# Altium project Coil_Driver.PrjPcb (part 3 of 3)

## Sheet Regulators.SchDoc
size A4
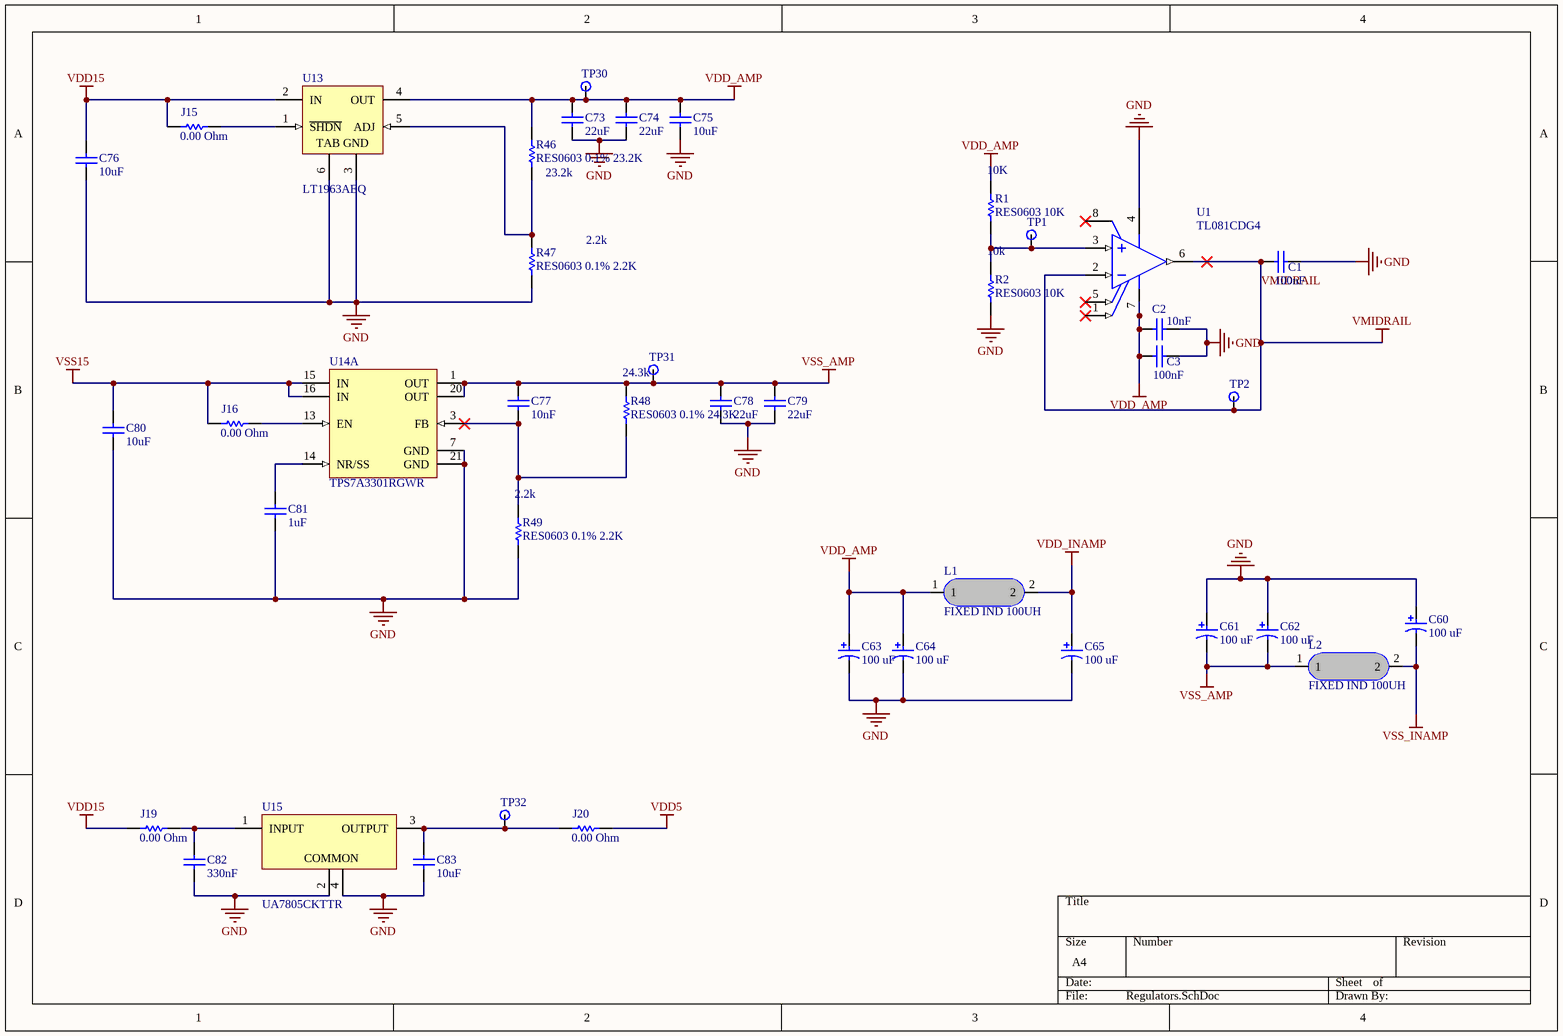
[diagram p8: Regulators.SchDoc]

### Parts
C1  value 100nF  [CAPC0603(1608)100_M]  (hidden comment: CAP 100nF 25V 0603(1608))
C2  value 10nF  [CAPC0603(1608)100_N]  (hidden comment: CAP 10nF 25V 0603(1608))
C3  value 100nF  [CAPC0603(1608)100_M]  (hidden comment: CAP 100nF 25V 0603(1608))
C60  100 uF  [CAPPR55-250-1120X630X1220]
C61  100 uF  [CAPPR55-250-1120X630X1220]
C62  100 uF  [CAPPR55-250-1120X630X1220]
C63  100 uF  [CAPPR55-250-1120X630X1220]
C64  100 uF  [CAPPR55-250-1120X630X1220]
C65  100 uF  [CAPPR55-250-1120X630X1220]
C73  value 22uF  [CAPC1206(3216)190_M]  (hidden comment: CAP 22uF 25V 1206(3216))
C74  value 22uF  [CAPC1206(3216)190_M]  (hidden comment: CAP 22uF 25V 1206(3216))
C75  value 10uF  [CAPC1206(3216)190_L]  (hidden comment: CAP 10uF 25V 1206(3216))
C76  value 10uF  [CAPC1206(3216)190_L]  (hidden comment: CAP 10uF 25V 1206(3216))
C77  value 10nF  [CAPC0603(1608)100_N]  (hidden comment: CAP 10nF 25V 0603(1608))
C78  value 22uF  [CAPC1206(3216)190_M]  (hidden comment: CAP 22uF 25V 1206(3216))
C79  value 22uF  [CAPC1206(3216)190_M]  (hidden comment: CAP 22uF 25V 1206(3216))
C80  value 10uF  [CAPC1206(3216)190_L]  (hidden comment: CAP 10uF 25V 1206(3216))
C81  value 1uF  [CAPC0603(1608)100_L]  (hidden comment: CAP 1uF 25V 0603(1608))
C82  value 330nF  [CAPC0603(1608)100_L]  (hidden comment: CAP 330nF 25V 0603(1608))
C83  value 10uF  [CAPC1206(3216)190_L]  (hidden comment: CAP 10uF 25V 1206(3216))
J15  0.00 Ohm  [RESC1206(3216)_M]
J16  0.00 Ohm  [RESC1206(3216)_M]
J19  0.00 Ohm  [RESC1206(3216)_M]
J20  0.00 Ohm  [RESC1206(3216)_M]
L1  FIXED IND 100UH  [FIXED IND 100UH 520MA 850 MOHM]
L2  FIXED IND 100UH  [FIXED IND 100UH 520MA 850 MOHM]
R1  RES0603 10K  value 10K  [RESC0603(1608)_L]
R2  RES0603 10K  value 10k  [RESC0603(1608)_L]
R46  RES0603 0.1% 23.2K  value 23.2k  [RESC0603(1608)_L]
R47  RES0603 0.1% 2.2K  value 2.2k  [RESC0603(1608)_L]
R48  RES0603 0.1% 24.3K  value 24.3k  [RESC0603(1608)_L]
R49  RES0603 0.1% 2.2K  value 2.2k  [RESC0603(1608)_L]
TP1  Testpoint  [0603 PROBE PAD]  (value not drawn)
TP2  Testpoint  [0603 PROBE PAD]  (value not drawn)
TP30  Testpoint  [0603 PROBE PAD]  (value not drawn)
TP31  Testpoint  [0603 PROBE PAD]  (value not drawn)
TP32  Testpoint  [0603 PROBE PAD]  (value not drawn)
U1  TL081CDG4  [TI-D8_N]
U13  LT1963AEQ  [LT-Q-5_M]
U14  TPS7A3301RGWR  [RGW0020A_V]  (part A of 2)
U15  UA7805CKTTR  [KTT0003A_V]

### Nets
GND: C1.1 C2.2 C3.1 C60.1 C61.1 C62.1 C63.2 C64.2 C65.2 C73.2 C74.2 C75.2 C76.2 C78.2 C79.2 C80.2 C81.1 C82.1 C83.2 R2.1 R47.1 R49.1 U1.4(VCC-) U13.3(GND) U13.6(TAB) U14.7(GND) U14.21(GND) U15.2(COMMON) U15.4(COMMON)
VDD5: J20.2
VDD15: C76.1 J15.1 J19.1 U13.2(IN)
VDD_AMP: C2.1 C3.2 C63.1 C64.1 C73.1 C74.1 C75.1 L1.1 R1.2 R46.2 TP30.0 U1.7(VCC+) U13.4(OUT)
VDD_INAMP: C65.1 L1.2
VMIDRAIL: C1.2 TP2.0 U1.2(IN-) U1.6(OUT)
VSS15: C80.1 J16.1 U14.15(IN) U14.16(IN)
VSS_AMP: C61.2 C62.2 C77.2 C78.1 C79.1 L2.1 R48.2 TP31.0 U14.1(OUT) U14.20(OUT)
VSS_INAMP: C60.2 L2.2
NetC77_1: C77.1 R48.1 R49.2 U14.3(FB)
NetC81_2: C81.2 U14.14(NR/SS)
NetC82_2: C82.2 J19.2 U15.1(INPUT)
NetC83_1: C83.1 J20.1 TP32.0 U15.3(OUTPUT)
NetJ15_2: J15.2 U13.1(~{SHDN})
NetJ16_2: J16.2 U14.13(EN)
NetR1_1: R1.1 R2.2 TP1.0 U1.3(IN+)
NetR46_1: R46.1 R47.2 U13.5(ADJ)

Not connected (* = marked no-connect by the designer): U1 1(OFFSET_N1)* 5(OFFSET_N2)* 8(NC)*

### Library data of the parts
C1 C3 = CMP-1035-02588-1: as C7 on sheet ChannelDriver; Max Thickness: 1 mm; Technology: SMT; Rated Voltage: 25 V; OrderURL: http://www.digikey.ie/product-detail/en/yageo/CC0603KRX7R8BB104/311-1341-1-ND/2103125; Supplier 1: Digi-Key; Supplier Part Number 1: 311-1341-1-ND
C2 C77 = CMP-1035-02317-1: as C4 on sheet ChannelDriver; Max Thickness: 1 mm; Rated Voltage: 25 V; Technology: SMT; OrderURL: http://www.digikey.ie/product-detail/en/yageo/CC0603KRX7R8BB103/311-1360-1-ND/2103144; Supplier 1: Digi-Key; Supplier Part Number 1: 311-1360-1-ND
C60-C65 = CMP-1665-00015-4: Aluminum Electrolytic Capacitor (Radial Lead Type), 100 uF, 35 V, -40 to 85 degC, 2-Pin THD, RoHS, Bulk; Manufacturer: Panasonic; Voltage Rating: 35 V; PackageReference: Radial; ComponentLink2URL: http://industrial.panasonic.com/cdbs/www-data/pdf/RDF0000/ABA0000C1047.pdf; DatasheetVersion: 03/2016; REACH SVHC: No SVHC; Mounting Technology: Through Hole; ComponentLink2Description: Datasheet; Packaging: Bulk; Lead Pitch: 2.5 mm; Height: 11.2 mm; Pins: 2; RoHSCompliant: true; Mount: Through Hole; Package Quantity: 200; Min Operating Temperature: -40 degC; Max Operating Temperature: 85 degC; PackageDescription: 2-Pin Through Hole Device, Dia 6.3 mm, Body Length 11.2 mm; ComponentLink1Description: Manufacturer URL; Length: 11.2 mm; ComponentLink1URL: http://www.panasonic.com/
C73 C74 C78 C79 = CMP-1037-04995-1: CAP 22uF 25V ±20% 1206 (3216 Metric) Thickness 1.9mm SMD; Case-EIA: 1206; Tolerance: Â±20%; Case-Metric: 3216; Rated Voltage: 25 V; Technology: SMT; Max Thickness: 1.9 mm; OrderURL: http://www.digikey.ie/product-detail/en/taiyo-yuden/TMK316BBJ226ML-T/587-3246-1-ND/3660105; Supplier Part Number 1: 587-3246-1-ND; Supplier 1: Digi-Key
C75 C76 C80 C83 = CMP-1037-04979-1: CAP 10uF 25V ±10% 1206 (3216 Metric) Thickness 1.9mm SMD; Case-EIA: 1206; Tolerance: Â±10%; Case-Metric: 3216; Rated Voltage: 25 V; Technology: SMT; Max Thickness: 1.9 mm; OrderURL: http://www.digikey.ie/product-detail/en/murata-electronics-north-america/GRM319R61E106KA12D/490-5525-1-ND/2334921; Supplier 1: Digi-Key; Supplier Part Number 1: 490-5525-1-ND
C81 = CMP-1035-02740-1: CAP 1uF 25V ±10% 0603 (1608 Metric) Thickness 1mm SMD; Tolerance: Â±10%; Case-Metric: 1608; Case-EIA: 0603; Technology: SMT; Rated Voltage: 25 V; Max Thickness: 1 mm; OrderURL: http://www.digikey.ie/product-detail/en/taiyo-yuden/TMK107BJ105KA-T/587-1248-1-ND/931025; Supplier Part Number 1: 587-1248-1-ND; Supplier 1: Digi-Key
C82 = CMP-1035-02674-1: CAP 330nF 25V ±10% 0603 (1608 Metric) Thickness 1mm SMD; Tolerance: Â±10%; Case-Metric: 1608; Case-EIA: 0603; Max Thickness: 1 mm; Technology: SMT; Rated Voltage: 25 V
J15 J16 J19 J20 = CMP-1014-00001-1: Jumper 1206 (3216 Metric); Tolerance: None; Case-EIA: 1206; Case-Metric: 3216; Technology: SMT; Power: None; Value: 0.00 Ohm; OrderURL: http://www.digikey.ie/product-detail/en/yageo/RC0603JR-070RL/311-0.0GRCT-ND/729622; Supplier 1: Digi-Key; Supplier Part Number 1: 311-0.0GRCT-ND
L1 L2 = 74408943101: FIXED IND 100UH 520MA 850 MOHM; Manufacturer: Wurth Electronics Inc.; Type: Wirewound; Material - Core: Ferrite; Inductance: 100µH; Tolerance: ±20%; Current - Saturation: 680mA; Shielding: Shielded; DC Resistance (DCR): 850 mOhm Max; Frequency - Self Resonant: 7.8MHz; Frequency - Test: 100kHz; Value: 1K; Published: 8-Jun-2000; LatestRevisionDate: 29-May-2009; LatestRevisionNote: IPC-7351 Footprint Added.; PackageReference: J1-0603; Publisher: Altium Limited; PackageDescription: Chip Resistor; Manufacturer Part Number: 74408943101; RoHS: RoHS Compliant; Category: Inductors, Coils, Chokes; Packaging: Tape & Reel (TR); Part Status: Active; Current Rating: 520mA; Q @ Freq: -; Ratings: -; Operating Temperature: -40°C ~ 125°C; Mounting Type: Surface Mount; Package / Case: Nonstandard; Supplier Device Package: -; Size / Dimension: 0.189" L x 0.189" W (4.80mm x 4.80mm); Height - Seated (Max): 0.161" (4.10mm); ComponentLink1URL: http://katalog.we-online.de/pbs/datasheet/74408943101.pdf; ComponentLink1Description: http://katalog.we-online.de/pbs/datasheet/74408943101.pdf; Supplier 1: Digi-Key; Supplier Part Number 1: 732-3038-2-ND; Stock 1: 9500; Pricing 1: 500=1.84552 (EUR)
R1 R2 = CMP-1591-00001-1: 0603 (1608 Metric) Chip Resistor; Manufacturer: Yageo; Manufacturer Part Number: RT0603BRD0710KL; Case-Metric: 1608; Case-EIA: 0603; Power (Watts): 0.1W, 1/10W; Temperature Coefficient: ±25ppm/°C; PackageReference: RESC0603(1608); Supplier 1: Digi-Key; Supplier Part Number 1: YAG1236CT-ND; RoHS: RoHS Compliant; Category: Resistors; Stock 1: 62928; Pricing 1: 1=0.3, 10=0.254, 25=0.1844, 50=0.1336, 100=0.0991, 250=0.07608, 500=0.05994, 1000=0.0415 (EUR); Packaging: Cut Tape (CT); Part Status: Active; Resistance (Ohms): 10k; Composition: Thin Film; Features: Moisture Resistant; Operating Temperature: -55°C ~ 155°C; Package / Case: 0603 (1608 Metric); Supplier Device Package: 0603; Size / Dimension: 0.063" L x 0.031" W (1.60mm x 0.80mm); Height - Seated (Max): 0.022" (0.55mm); Failure Rate: -; ComponentLink1URL: http://www.yageo.com/documents/recent/PYu-RT_1-to-0.01_RoHS_L_7.pdf; ComponentLink1Description: http://www.yageo.com/documents/recent/PYu-RT_1-to-0.01_RoHS_L_7.pdf
R46 = CMP-1591-00001-1: 0603 (1608 Metric) Chip Resistor; Manufacturer: Panasonic Electronic Components; Manufacturer Part Number: ERA-3AEB2322V; Case-Metric: 1608; Case-EIA: 0603; Power (Watts): 0.1W, 1/10W; Temperature Coefficient: ±25ppm/°C; PackageReference: RESC0603(1608); Supplier 1: Digi-Key; Supplier Part Number 1: P23.2KDBCT-ND; RoHS: RoHS Compliant; Category: Resistors; Stock 1: 17441; Pricing 1: 1=0.37, 10=0.27, 25=0.196, 50=0.1422, 100=0.1054, 250=0.08088, 500=0.06372, 1000=0.04411 (EUR); Packaging: Cut Tape (CT); Part Status: Active; Resistance (Ohms): 23.2k; Composition: Thin Film; Features: Automotive AEC-Q200; Operating Temperature: -55°C ~ 155°C; Package / Case: 0603 (1608 Metric); Supplier Device Package: 0603; Size / Dimension: 0.063" L x 0.031" W (1.60mm x 0.80mm); Height - Seated (Max): 0.022" (0.55mm); Failure Rate: -; ComponentLink1URL: https://industrial.panasonic.com/cdbs/www-data/pdf/RDM0000/AOA0000C237.pdf; ComponentLink1Description: https://industrial.panasonic.com/cdbs/www-data/pdf/RDM0000/AOA0000C237.pdf
R47 R49 = CMP-1591-00001-1: 0603 (1608 Metric) Chip Resistor; Manufacturer: Panasonic Electronic Components; Manufacturer Part Number: ERA-3AEB222V; Case-Metric: 1608; Case-EIA: 0603; Power (Watts): 0.1W, 1/10W; Temperature Coefficient: ±25ppm/°C; PackageReference: RESC0603(1608); Supplier 1: Digi-Key; Supplier Part Number 1: P2.2KDBCT-ND; RoHS: RoHS Compliant; Category: Resistors; Stock 1: 91131; Pricing 1: 1=0.37, 10=0.27, 25=0.196, 50=0.1422, 100=0.1054, 250=0.08088, 500=0.06372, 1000=0.04411 (EUR); Packaging: Cut Tape (CT); Part Status: Active; Resistance (Ohms): 2.2k; Composition: Thin Film; Features: Automotive AEC-Q200; Operating Temperature: -55°C ~ 155°C; Package / Case: 0603 (1608 Metric); Supplier Device Package: 0603; Size / Dimension: 0.063" L x 0.031" W (1.60mm x 0.80mm); Height - Seated (Max): 0.022" (0.55mm); Failure Rate: -; ComponentLink1URL: https://industrial.panasonic.com/cdbs/www-data/pdf/RDM0000/AOA0000C237.pdf; ComponentLink1Description: https://industrial.panasonic.com/cdbs/www-data/pdf/RDM0000/AOA0000C237.pdf
R48 = CMP-1591-00001-1: 0603 (1608 Metric) Chip Resistor; Manufacturer: Panasonic Electronic Components; Manufacturer Part Number: ERA-3AEB2432V; Case-Metric: 1608; Case-EIA: 0603; Power (Watts): 0.1W, 1/10W; Temperature Coefficient: ±25ppm/°C; PackageReference: RESC0603(1608); Supplier 1: Digi-Key; Supplier Part Number 1: P24.3KDBCT-ND; RoHS: RoHS Compliant; Category: Resistors; Stock 1: 12451; Pricing 1: 1=0.37, 10=0.27, 25=0.196, 50=0.1422, 100=0.1054, 250=0.08088, 500=0.06372, 1000=0.04411 (EUR); Packaging: Cut Tape (CT); Part Status: Active; Resistance (Ohms): 24.3k; Composition: Thin Film; Features: Automotive AEC-Q200; Operating Temperature: -55°C ~ 155°C; Package / Case: 0603 (1608 Metric); Supplier Device Package: 0603; Size / Dimension: 0.063" L x 0.031" W (1.60mm x 0.80mm); Height - Seated (Max): 0.022" (0.55mm); Failure Rate: -; ComponentLink1URL: https://industrial.panasonic.com/cdbs/www-data/pdf/RDM0000/AOA0000C237.pdf; ComponentLink1Description: https://industrial.panasonic.com/cdbs/www-data/pdf/RDM0000/AOA0000C237.pdf
TP1 TP2 TP30-TP32 = Testpoint: as TP3 on sheet ChannelDriver; OrderURL: http://www.digikey.ie/product-detail/en/te-connectivity-amp-connectors/RCU-0C/A106145CT-ND/3477802; Value: *; Width: 0.8; Height: 1.15mm; Length: 1.60mm; Supplier Part Number 1: A106145CT-ND; Supplier 1: Digi-Key
U1 = CMP-0017-00506-1: as U2 on sheet ChannelDriver; ComponentLink3Description: Package Specification; Eco-Plan: Green (RoHS & no Sb/Br); PackageReference: D8; ComponentLink1Description: Manufacturer URL; PackageDescription: 8-Pin Plastic Small Outline, Body 4.9 x 3.9 mm, Pitch 1.27 mm; DatasheetVersion: SLOS081G; PackageVersion: 4040047-3/M, 06/2011; Code_JEDEC: MS-012; ComponentLink2URL: http://www.ti.com/lit/ds/symlink/tl081.pdf; ComponentLink1URL: http://www.ti.com/; Offset Drift(Typ)(uV/C): 18; Mounting Technology: Surface Mount; ComponentLink2Description: Datasheet; PartNumber: TL081CDG4; ComponentLink3URL: http://www.ti.com/litv/pdf/msoi002j; OrderURL: http://www.digikey.ie/product-detail/en/texas-instruments/TL081CDR/296-15001-1-ND/562657; Supplier 1: Digi-Key; RoHS: RoHS Compliant; Category: Integrated Circuits (ICs); Stock 1: 9909; Pricing 1: 1=0.44, 10=0.375, 100=0.28, 500=0.22002, 1000=0.17001 (EUR); Packaging: Cut Tape (CT); Part Status: Active; Number of Circuits: 1; Output Type: -; -3db Bandwidth: -; Current - Output / Channel: -; Operating Temperature: 0°C ~ 70°C; Mounting Type: Surface Mount; Package / Case: 8-SOIC (0.154", 3.90mm Width); Supplier Device Package: 8-SOIC; ComponentLink4URL: http://www.ti.com/lit/ds/symlink/tl081a.pdf; ComponentLink4Description: http://www.ti.com/lit/ds/symlink/tl081a.pdf
U13 = CMP-0476-01172-1: 1.5 A, Low Noise, Fast Transient Response LDO Regulator, 2.1 to 20 V Vin, Adjustable Vout, 5-pin DPAK (Q-5), -40 to 125 degC; Manufacturer: Linear Technology; Iout(mA): 1500; Isupply(mA): 1; Noise(uV): 40; Vin Max(V): 20; Shutdown Current(uA): 0.01; Discrete Pass Element: no; Output Voltage: Adj; Vin Min(V): 2.1; Dropout Voltage(V): 0.34; Vout Min(V): 1.21; PSRR(dB): 63; PackageReference: Q-5; Number of Outputs: 1; ComponentLink2URL: http://cds.linear.com/docs/en/datasheet/1963afe.pdf; ComponentLink2Description: Datasheet; Mounting Technology: Surface Mount; DatasheetVersion: Rev. E; ComponentLink3URL: http://cds.linear.com/docs/en/packaging/Q%20DD5%2005-08-1461%20Rev%20F.pdf; ComponentLink1Description: Manufacturer URL; PackageDescription: 5-Pin Plastic DD Pak, Body 10.2235 x 8.89 mm, Pitch 1.702 mm; ComponentLink3Description: Package Specification; Vout Max(V): 20; ComponentLink1URL: http://www.linear.com/; PackageVersion: Rev. F, 09/2011; RoHS: FALSE; PartNumber: LT1963AEQ
U14 = CMP-0395-01391-2: Single Output High PSRR LDO, 1 A, Adjustable -1.18 to -33 V Output, -3 to -36 V Input, with Ultra-Low Noise, 20-pin VQFN (RGW), -40 to 125 degC, Green (RoHS & no Sb/Br); Manufacturer: Texas Instruments; SubFamily: Single Channel LDO; Vdo(Typ)(mV): 290; Iq(Typ)(mA): 0.21; Iout(Max)(A): 1; Accuracy(%): 1.5; PackageDescription: 20-Pin Plastic Quad Flat No-Pin, 5 x 5 mm Body, 0.65 mm Pitch, 3.15 x 3.15 mm Exposed Pad; DatasheetVersion: SBVS169B; ComponentLink1Description: Manufacturer URL; ComponentLink2Description: Datasheet; PartNumber: TPS7A3301RGWR; Eco-Plan: Green (RoHS & no Sb/Br); Vin(Min)(V): -3; ComponentLink2URL: http://www.ti.com/general/docs/lit/getliterature.tsp?genericPartNumber=TPS7A3301&fileType=pdf; ComponentLink3Description: Package Specification; PackageReference: RGW0020A; Vout Adj(Max)(V): -33; Vin(Max)(V): -36; Vout Adj(Min)(V): -1.18; ComponentLink1URL: http://www.ti.com/; Code_JEDEC: MO-220; ComponentLink3URL: http://www.ti.com/litv/pdf/mpqf122b; Mounting Technology: Surface Mount
U15 = CMP-1685-00014-1: Fixed Positive Voltage Regulator, 7 to 25 V, 1.5 A, 0 to 125 degC, 3-Pin DDPAK (KTT), Green (RoHS / & no Sb/Br), Tape and Reel; Tolerance: 1%; Resistance: 220 Ohm; Case\Package: 0603; Voltage Rating: 50 V; Power Rating: 100 mW; Package Quantity: 5000; Min Operating Temperature: -55 degC; ComponentLink2Description: Datasheet; ComponentLink1Description: Manufacturer URL; RoHSCompliant: true; Mount: Surface Mount; PackageDescription: 3-Pin Surface Mount Device, Body 10.16 x 9.015 mm, Pitch 2.54 mm; Width: 0.8 mm; Max Operating Temperature: 155 degC; Pins: 2; ComponentLink1URL: http://www.ti.com/; Case Code (Metric): 1608; Packaging: Tape and Reel; Case Code (Imperial): 0603; Height: 0.45 mm; Code_JEDEC: TO-263; DatasheetVersion: SLVS056P, 01/2015; Length: 1.6 mm; REACH SVHC: No SVHC; ComponentLink2URL: http://www.ti.com/lit/ds/symlink/ua7805.pdf; PackageReference: KTT0003A; Voltage Rating (DC): 50 V

## Sheet CurrentSense.SchDoc
size A4
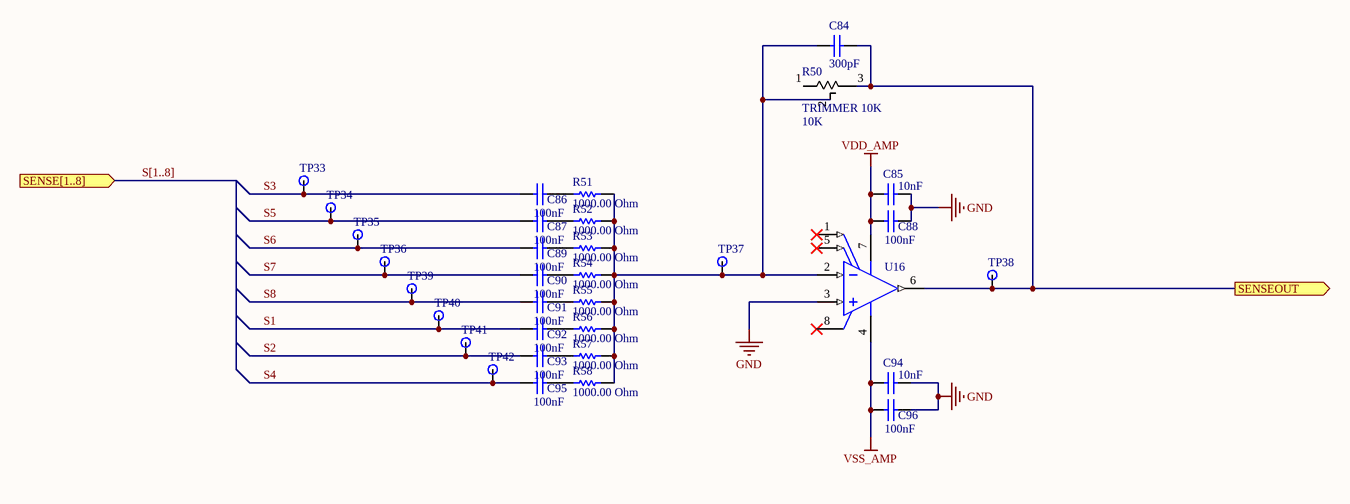
[diagram p9: CurrentSense.SchDoc]

### Parts
C84  value 300pF  [CAPC0603(1608)100_N]  (hidden comment: CAP 300pF 25V 0603(1608))
C85  value 10nF  [CAPC0603(1608)100_N]  (hidden comment: CAP 10nF 25V 0603(1608))
C86  value 100nF  [CAPC0603(1608)100_M]  (hidden comment: CAP 100nF 25V 0603(1608))
C87  value 100nF  [CAPC0603(1608)100_M]  (hidden comment: CAP 100nF 25V 0603(1608))
C88  value 100nF  [CAPC0603(1608)100_M]  (hidden comment: CAP 100nF 25V 0603(1608))
C89  value 100nF  [CAPC0603(1608)100_M]  (hidden comment: CAP 100nF 25V 0603(1608))
C90  value 100nF  [CAPC0603(1608)100_M]  (hidden comment: CAP 100nF 25V 0603(1608))
C91  value 100nF  [CAPC0603(1608)100_M]  (hidden comment: CAP 100nF 25V 0603(1608))
C92  value 100nF  [CAPC0603(1608)100_M]  (hidden comment: CAP 100nF 25V 0603(1608))
C93  value 100nF  [CAPC0603(1608)100_M]  (hidden comment: CAP 100nF 25V 0603(1608))
C94  value 10nF  [CAPC0603(1608)100_N]  (hidden comment: CAP 10nF 25V 0603(1608))
C95  value 100nF  [CAPC0603(1608)100_M]  (hidden comment: CAP 100nF 25V 0603(1608))
C96  value 100nF  [CAPC0603(1608)100_M]  (hidden comment: CAP 100nF 25V 0603(1608))
R50  TRIMMER 10K  value 10K  [TRIMMER 10K]
R51  value 1000.00 Ohm  [RESC0603(1608)_L]  (hidden comment: 1K 5% 0603(1608))
R52  value 1000.00 Ohm  [RESC0603(1608)_L]  (hidden comment: 1K 5% 0603(1608))
R53  value 1000.00 Ohm  [RESC0603(1608)_L]  (hidden comment: 1K 5% 0603(1608))
R54  value 1000.00 Ohm  [RESC0603(1608)_L]  (hidden comment: 1K 5% 0603(1608))
R55  value 1000.00 Ohm  [RESC0603(1608)_L]  (hidden comment: 1K 5% 0603(1608))
R56  value 1000.00 Ohm  [RESC0603(1608)_L]  (hidden comment: 1K 5% 0603(1608))
R57  value 1000.00 Ohm  [RESC0603(1608)_L]  (hidden comment: 1K 5% 0603(1608))
R58  value 1000.00 Ohm  [RESC0603(1608)_L]  (hidden comment: 1K 5% 0603(1608))
TP33  Testpoint  [0603 PROBE PAD]  (value not drawn)
TP34  Testpoint  [0603 PROBE PAD]  (value not drawn)
TP35  Testpoint  [0603 PROBE PAD]  (value not drawn)
TP36  Testpoint  [0603 PROBE PAD]  (value not drawn)
TP37  Testpoint  [0603 PROBE PAD]  (value not drawn)
TP38  Testpoint  [0603 PROBE PAD]  (value not drawn)
TP39  Testpoint  [0603 PROBE PAD]  (value not drawn)
TP40  Testpoint  [0603 PROBE PAD]  (value not drawn)
TP41  Testpoint  [0603 PROBE PAD]  (value not drawn)
TP42  Testpoint  [0603 PROBE PAD]  (value not drawn)
U16  TL081CDG4  [TI-D8_N]  (value not drawn)

### Ports
SENSE[1..8] (in), SENSEOUT (out)

### Nets
GND: C85.2 C88.1 C94.2 C96.1 U16.3(IN+)
VDD_AMP: C85.1 C88.2 U16.7(VCC+)
VSS_AMP: C94.1 C96.2 U16.4(VCC-)
S1: C92.2 TP40.0  [project net Coil_In1]
S2: C93.2 TP41.0  [project net Coil_In2]
S3: C86.2 TP33.0  [project net Coil_In3]
S4: C95.2 TP42.0  [project net Coil_In4]
S5: C87.2 TP34.0  [project net Coil_In5]
S6: C89.2 TP35.0  [project net Coil_In6]
S7: C90.2 TP36.0  [project net Coil_In7]
S8: C91.2 TP39.0  [project net Coil_In8]
SENSEIN: C84.1 R50.3 TP38.0 U16.6(OUT) ; port SENSEOUT
NetC84_2: C84.2 R50.2 R51.1 R52.1 R53.1 R54.1 R55.1 R56.1 R57.1 R58.1 TP37.0 U16.2(IN-)
NetC86_1: C86.1 R51.2
NetC87_1: C87.1 R52.2
NetC89_1: C89.1 R53.2
NetC90_1: C90.1 R54.2
NetC91_1: C91.1 R55.2
NetC92_1: C92.1 R56.2
NetC93_1: C93.1 R57.2
NetC95_1: C95.1 R58.2

Not connected (* = marked no-connect by the designer): R50 1; U16 1(OFFSET_N1)* 5(OFFSET_N2)* 8(NC)*

### Buses and harness runs
bus S[1..8] = port SENSE[1..8]

### Library data of the parts
C84 = CMP-1035-01546-1: CAP 300pF 25V ±10% 0603 (1608 Metric) Thickness 1mm SMD; Tolerance: Â±10%; Case-EIA: 0603; Case-Metric: 1608; Rated Voltage: 25 V; Technology: SMT; Max Thickness: 1 mm
C85 C94 = CMP-1035-02317-1: CAP 10nF 25V ±10% 0603 (1608 Metric) Thickness 1mm SMD; Tolerance: Â±10%; Case-Metric: 1608; Case-EIA: 0603; Max Thickness: 1 mm; Rated Voltage: 25 V; Technology: SMT; OrderURL: http://www.digikey.ie/product-detail/en/yageo/CC0603KRX7R8BB103/311-1360-1-ND/2103144; Supplier 1: Digi-Key; Supplier Part Number 1: 311-1360-1-ND
C86-C93 C95 C96 = CMP-1035-02588-1: CAP 100nF 25V ±10% 0603 (1608 Metric) Thickness 1mm SMD; Case-Metric: 1608; Case-EIA: 0603; Tolerance: Â±10%; Max Thickness: 1 mm; Technology: SMT; Rated Voltage: 25 V; OrderURL: http://www.digikey.ie/product-detail/en/yageo/CC0603KRX7R8BB104/311-1341-1-ND/2103125; Supplier 1: Digi-Key; Supplier Part Number 1: 311-1341-1-ND
R50 = TRIMMER 10K: TRIMMER 10K OHM 0.5W TH; Manufacturer: TE Connectivity Passive Product; Manufacturer Part Number: 1-1623849-0; Power (Watts): 0.5W, 1/2W; Tolerance: ±10%; Temperature Coefficient: ±100ppm/°C; Number of Turns: 25; Adjustment Type: Top Adjustment; Resistive Material: Cermet; Published: 8-Jun-2000; LatestRevisionDate: 29-May-2009; LatestRevisionNote: IPC-7351 Footprint Added.; PackageReference: J1-0603; Publisher: Altium Limited; PackageDescription: Chip Resistor; RoHS: RoHS Compliant; Category: Potentiometers, Variable Resistors; Packaging: Bulk; Part Status: Active; Resistance (Ohms): 10k; Mounting Type: Through Hole; Termination Style: PC Pins; Size / Dimension: Rectangular - 0.374" x 0.185" Face x 0.394" H (9.50mm x 4.70mm x 10.00mm); ComponentLink1URL: http://www.te.com/commerce/DocumentDelivery/DDEController?Action=srchrtrv&DocNm=1623849&DocType=Customer+Drawing&DocLang=English; ComponentLink1Description: http://www.te.com/commerce/DocumentDelivery/DDEController?Action=srchrtrv&DocNm=1623849&DocType=Customer+Drawing&DocLang=English; Supplier 1: Digi-Key; Supplier Part Number 1: A105870-ND; Stock 1: 5809; Pricing 1: 1=0.89, 10=0.786, 25=0.7076, 50=0.6816, 100=0.6554, 250=0.61608, 500=0.5243, 1000=0.48499, 5000=0.39848 (EUR)
R51-R58 = CMP-1012-00074-1: 1K 0.1W 5% 0603 (1608 Metric)  SMD; Case-EIA: 0603; Case-Metric: 1608; Technology: SMT; Tolerance: 5 %; Power: 0.1 W; OrderURL: http://www.digikey.ie/product-detail/en/yageo/RC0603JR-071KL/311-1.0KGRCT-ND/729624; Supplier 1: Digi-Key; Supplier Part Number 1: 311-1.0KGRCT-ND
TP33-TP42 = Testpoint: 0.063" x 0.031" x 0.045" (1.60mm x 0.80mm x 1.15mm); OrderURL: http://www.digikey.ie/product-detail/en/te-connectivity-amp-connectors/RCU-0C/A106145CT-ND/3477802; Value: *; Width: 0.8; Height: 1.15mm; Length: 1.60mm; Supplier Part Number 1: A106145CT-ND; Supplier 1: Digi-Key
U16 = CMP-0017-00506-1: JFET-Input Operational Amplifier, 7 to 36 V, 0 to 70 degC, 8-pin SOIC (D8), Green (RoHS & no Sb/Br); Manufacturer: Texas Instruments; Manufacturer Part Number: TL081CDR; Total Supply Voltage(Min)(+5V is 5, +/-5V is 10): 7; Rating: Military; CMRR(Min)(dB): 70; IIB(Max)(pA): 400; Iq per channel(Max)(mA): 2.8; Vio (25C)(Max)(mV): 15; Vn at 1kHz(Typ)(nV/rtHz): 18; Slew Rate(Typ)(V/us): 13; Sub Family: General Purpose Amplifier, High Supply Voltage Amplifier (>=30V); Total Supply Voltage(Max)(+5V is 5, +/-5V is 10): 36; Number of Channels: 1; GBW(Typ)(MHz): 3; Amplifier Type: J-FET; Slew Rate: 13 V/µs; Gain Bandwidth Product: 3MHz; Current - Input Bias: 30pA; Voltage - Input Offset: 3mV; Current - Supply: 1.4mA; Voltage - Supply, Single/Dual (±): 7 V ~ 36 V, ±3.5 V ~ 18 V; ComponentLink3Description: Package Specification; Eco-Plan: Green (RoHS & no Sb/Br); PackageReference: D8; ComponentLink1Description: Manufacturer URL; PackageDescription: 8-Pin Plastic Small Outline, Body 4.9 x 3.9 mm, Pitch 1.27 mm; DatasheetVersion: SLOS081G; PackageVersion: 4040047-3/M, 06/2011; Code_JEDEC: MS-012; ComponentLink2URL: http://www.ti.com/lit/ds/symlink/tl081.pdf; ComponentLink1URL: http://www.ti.com/; Offset Drift(Typ)(uV/C): 18; Mounting Technology: Surface Mount; ComponentLink2Description: Datasheet; PartNumber: TL081CDG4; ComponentLink3URL: http://www.ti.com/litv/pdf/msoi002j; OrderURL: http://www.digikey.ie/product-detail/en/texas-instruments/TL081CDR/296-15001-1-ND/562657; Supplier 1: Digi-Key; Supplier Part Number 1: 296-15001-1-ND; RoHS: RoHS Compliant; Category: Integrated Circuits (ICs); Stock 1: 9909; Pricing 1: 1=0.44, 10=0.375, 100=0.28, 500=0.22002, 1000=0.17001 (EUR); Packaging: Cut Tape (CT); Part Status: Active; Number of Circuits: 1; Output Type: -; -3db Bandwidth: -; Current - Output / Channel: -; Operating Temperature: 0°C ~ 70°C; Mounting Type: Surface Mount; Package / Case: 8-SOIC (0.154", 3.90mm Width); Supplier Device Package: 8-SOIC; ComponentLink4URL: http://www.ti.com/lit/ds/symlink/tl081a.pdf; ComponentLink4Description: http://www.ti.com/lit/ds/symlink/tl081a.pdf

## Nets that join several sheets
GND: System (P18.9 P18.10), Ch1 (27 pins), Ch2 (27 pins), Ch3 (27 pins), Ch4 (27 pins), Ch5 (27 pins), Ch6 (27 pins), Ch7 (27 pins), Ch8 (27 pins), Teensy3 (MCU1.1 MCU1.27), ClockDriver (10 pins), IA1 (37 pins), IA2 (37 pins), IA3 (37 pins), IA4 (37 pins), IA5 (37 pins), IA6 (37 pins), IA7 (37 pins), IA8 (37 pins), EmitterConnector (11 pins), DAQ (36 pins), PowerIn (12 pins), Regulators (29 pins), CurrentSense (5 pins)
VDD5: System (P18.7 P18.8), Ch1 (5 pins), Ch2 (5 pins), Ch3 (5 pins), Ch4 (5 pins), Ch5 (5 pins), Ch6 (5 pins), Ch7 (5 pins), Ch8 (5 pins), Teensy3 (9 pins), ClockDriver (7 pins), Regulators (J20.2)
VDD15: System (P18.1), Ch1 (C15_Ch1.2 C20_Ch1.1 U5_Ch1.5), Ch2 (C15_Ch2.2 C20_Ch2.1 U5_Ch2.5), Ch3 (C15_Ch3.2 C20_Ch3.1 U5_Ch3.5), Ch4 (C15_Ch4.2 C20_Ch4.1 U5_Ch4.5), Ch5 (C15_Ch5.2 C20_Ch5.1 U5_Ch5.5), Ch6 (C15_Ch6.2 C20_Ch6.1 U5_Ch6.5), Ch7 (C15_Ch7.2 C20_Ch7.1 U5_Ch7.5), Ch8 (C15_Ch8.2 C20_Ch8.1 U5_Ch8.5), EmitterConnector (R69.1), PowerIn (8 pins), Regulators (C76.1 J15.1 J19.1 U13.2)
VDD_AMP: System (P18.3), Ch1 (8 pins), Ch2 (8 pins), Ch3 (8 pins), Ch4 (8 pins), Ch5 (8 pins), Ch6 (8 pins), Ch7 (8 pins), Ch8 (8 pins), Regulators (13 pins), CurrentSense (C85.1 C88.2 U16.7)
VDD_INAMP: System (P18.5), IA1 (13 pins), IA2 (13 pins), IA3 (13 pins), IA4 (13 pins), IA5 (13 pins), IA6 (13 pins), IA7 (13 pins), IA8 (13 pins), Regulators (C65.1 L1.2)
VMIDRAIL: Ch1 (C33_Ch1.2 U5_Ch1.2), Ch2 (C33_Ch2.2 U5_Ch2.2), Ch3 (C33_Ch3.2 U5_Ch3.2), Ch4 (C33_Ch4.2 U5_Ch4.2), Ch5 (C33_Ch5.2 U5_Ch5.2), Ch6 (C33_Ch6.2 U5_Ch6.2), Ch7 (C33_Ch7.2 U5_Ch7.2), Ch8 (C33_Ch8.2 U5_Ch8.2), Regulators (C1.2 TP2.0 U1.2 U1.6)
VSS15: System (P18.2), PowerIn (C69.1 CH2.2 TP29.0), Regulators (C80.1 J16.1 U14.15 U14.16)
VSS_AMP: System (P18.4), Ch1 (6 pins), Ch2 (6 pins), Ch3 (6 pins), Ch4 (6 pins), Ch5 (6 pins), Ch6 (6 pins), Ch7 (6 pins), Ch8 (6 pins), PowerIn (P11.2), Regulators (10 pins), CurrentSense (C94.1 C96.2 U16.4)
VSS_INAMP: System (P18.6), IA1 (13 pins), IA2 (13 pins), IA3 (13 pins), IA4 (13 pins), IA5 (13 pins), IA6 (13 pins), IA7 (13 pins), IA8 (13 pins), Regulators (C60.2 L2.2)
Coil_In1: Ch1 (7 pins), EmitterConnector (R41.14), CurrentSense (C92.2 TP40.0)
Coil_In2: Ch2 (7 pins), EmitterConnector (R41.3), CurrentSense (C93.2 TP41.0)
Coil_In3: Ch3 (7 pins), EmitterConnector (R41.17), CurrentSense (C86.2 TP33.0)
Coil_In4: Ch4 (7 pins), EmitterConnector (R41.6), CurrentSense (C95.2 TP42.0)
Coil_In5: Ch5 (7 pins), EmitterConnector (R41.9), CurrentSense (C87.2 TP34.0)
Coil_In6: Ch6 (7 pins), EmitterConnector (R41.23), CurrentSense (C89.2 TP35.0)
Coil_In7: Ch7 (7 pins), EmitterConnector (R41.12), CurrentSense (C90.2 TP36.0)
Coil_In8: Ch8 (7 pins), EmitterConnector (R41.26), CurrentSense (C91.2 TP39.0)
Coil_Out1: Ch1 (C16_Ch1.2 C17_Ch1.2 C18_Ch1.2 C26_Ch1.2), EmitterConnector (R41.1)
Coil_Out2: Ch2 (C16_Ch2.2 C17_Ch2.2 C18_Ch2.2 C26_Ch2.2), EmitterConnector (R41.15)
Coil_Out3: Ch3 (C16_Ch3.2 C17_Ch3.2 C18_Ch3.2 C26_Ch3.2), EmitterConnector (R41.4)
Coil_Out4: Ch4 (C16_Ch4.2 C17_Ch4.2 C18_Ch4.2 C26_Ch4.2), EmitterConnector (R41.18)
Coil_Out5: Ch5 (C16_Ch5.2 C17_Ch5.2 C18_Ch5.2 C26_Ch5.2), EmitterConnector (R41.21)
Coil_Out6: Ch6 (C16_Ch6.2 C17_Ch6.2 C18_Ch6.2 C26_Ch6.2), EmitterConnector (R41.10)
Coil_Out7: Ch7 (C16_Ch7.2 C17_Ch7.2 C18_Ch7.2 C26_Ch7.2), EmitterConnector (R41.24)
Coil_Out8: Ch8 (C16_Ch8.2 C17_Ch8.2 C18_Ch8.2 C26_Ch8.2), EmitterConnector (R41.13)
MCLK: Ch1 (U3_Ch1.5), ClockDriver (R42.2)
MCLK: Ch2 (U3_Ch2.5), ClockDriver (R43.2)
MCLK: Ch3 (U3_Ch3.5), ClockDriver (R59.2)
MCLK: Ch4 (U3_Ch4.5), ClockDriver (R63.2)
MCLK: Ch5 (U3_Ch5.5), ClockDriver (R64.2)
MCLK: Ch6 (U3_Ch6.5), ClockDriver (R66.2)
MCLK: Ch7 (U3_Ch7.5), ClockDriver (R67.2)
MCLK: Ch8 (U3_Ch8.5), ClockDriver (R68.2)
MOSI: Ch1 (U3_Ch1.6), Ch2 (U3_Ch2.6), Ch3 (U3_Ch3.6), Ch4 (U3_Ch4.6), Ch5 (U3_Ch5.6), Ch6 (U3_Ch6.6), Ch7 (U3_Ch7.6), Ch8 (U3_Ch8.6), Teensy3 (J13.1 P8.8)
SCLK: Ch1 (U3_Ch1.7), Ch2 (U3_Ch2.7), Ch3 (U3_Ch3.7), Ch4 (U3_Ch4.7), Ch5 (U3_Ch5.7), Ch6 (U3_Ch6.7), Ch7 (U3_Ch7.7), Ch8 (U3_Ch8.7), Teensy3 (P6.10 P7.5)
SENSEA1: IA1 (J2_IA1.2), DAQ (DAQ1.28 DAQ2.10)
SENSEA2: IA2 (J2_IA2.2), DAQ (DAQ1.31 DAQ2.7)
SENSEA3: IA3 (J2_IA3.2), DAQ (DAQ1.34 DAQ2.4)
SENSEA4: IA4 (J2_IA4.2), DAQ (DAQ1.36 DAQ2.2)
SENSEA5: IA5 (J2_IA5.2), DAQ (DAQ1.40 DAQ2.38)
SENSEA6: IA6 (J2_IA6.2), DAQ (DAQ1.42 DAQ2.36)
SENSEA7: IA7 (J2_IA7.2), DAQ (DAQ1.45 DAQ2.32)
SENSEA8: IA8 (J2_IA8.2), DAQ (DAQ1.48 DAQ2.30)
SENSEB1: IA1 (J3_IA1.2), DAQ (DAQ1.27 DAQ2.11)
SENSEB2: IA2 (J3_IA2.2), DAQ (DAQ1.30 DAQ2.8)
SENSEB3: IA3 (J3_IA3.2), DAQ (DAQ1.33 DAQ2.5)
SENSEB4: IA4 (J3_IA4.2), DAQ (DAQ1.37 DAQ2.1)
SENSEB5: IA5 (J3_IA5.2), DAQ (J1.1)
SENSEB6: IA6 (J3_IA6.2), DAQ (DAQ1.43 DAQ2.35)
SENSEB7: IA7 (J3_IA7.2), DAQ (DAQ1.46 DAQ2.33)
SENSEB8: IA8 (J3_IA8.2), DAQ (DAQ1.49 DAQ2.29)
SENSEIN: DAQ (J17.1 J18.2), CurrentSense (C84.1 R50.3 TP38.0 U16.6)
SS: Ch1 (U3_Ch1.8), Teensy3 (J8.1 R24.2)
SS: Ch2 (U3_Ch2.8), Teensy3 (J7.1 R23.2)
SS: Ch3 (U3_Ch3.8), Teensy3 (J6.1 R22.2)
SS: Ch4 (U3_Ch4.8), Teensy3 (J5.1 R21.2)
SS: Ch5 (U3_Ch5.8), Teensy3 (J12.1 R20.2)
SS: Ch6 (U3_Ch6.8), Teensy3 (J11.1 R19.2)
SS: Ch7 (U3_Ch7.8), Teensy3 (J10.1 R18.2)
SS: Ch8 (U3_Ch8.8), Teensy3 (J9.1 R17.2)